# EAGLE design modular_expansion_joystick_only (EAGLE 9.2.1)
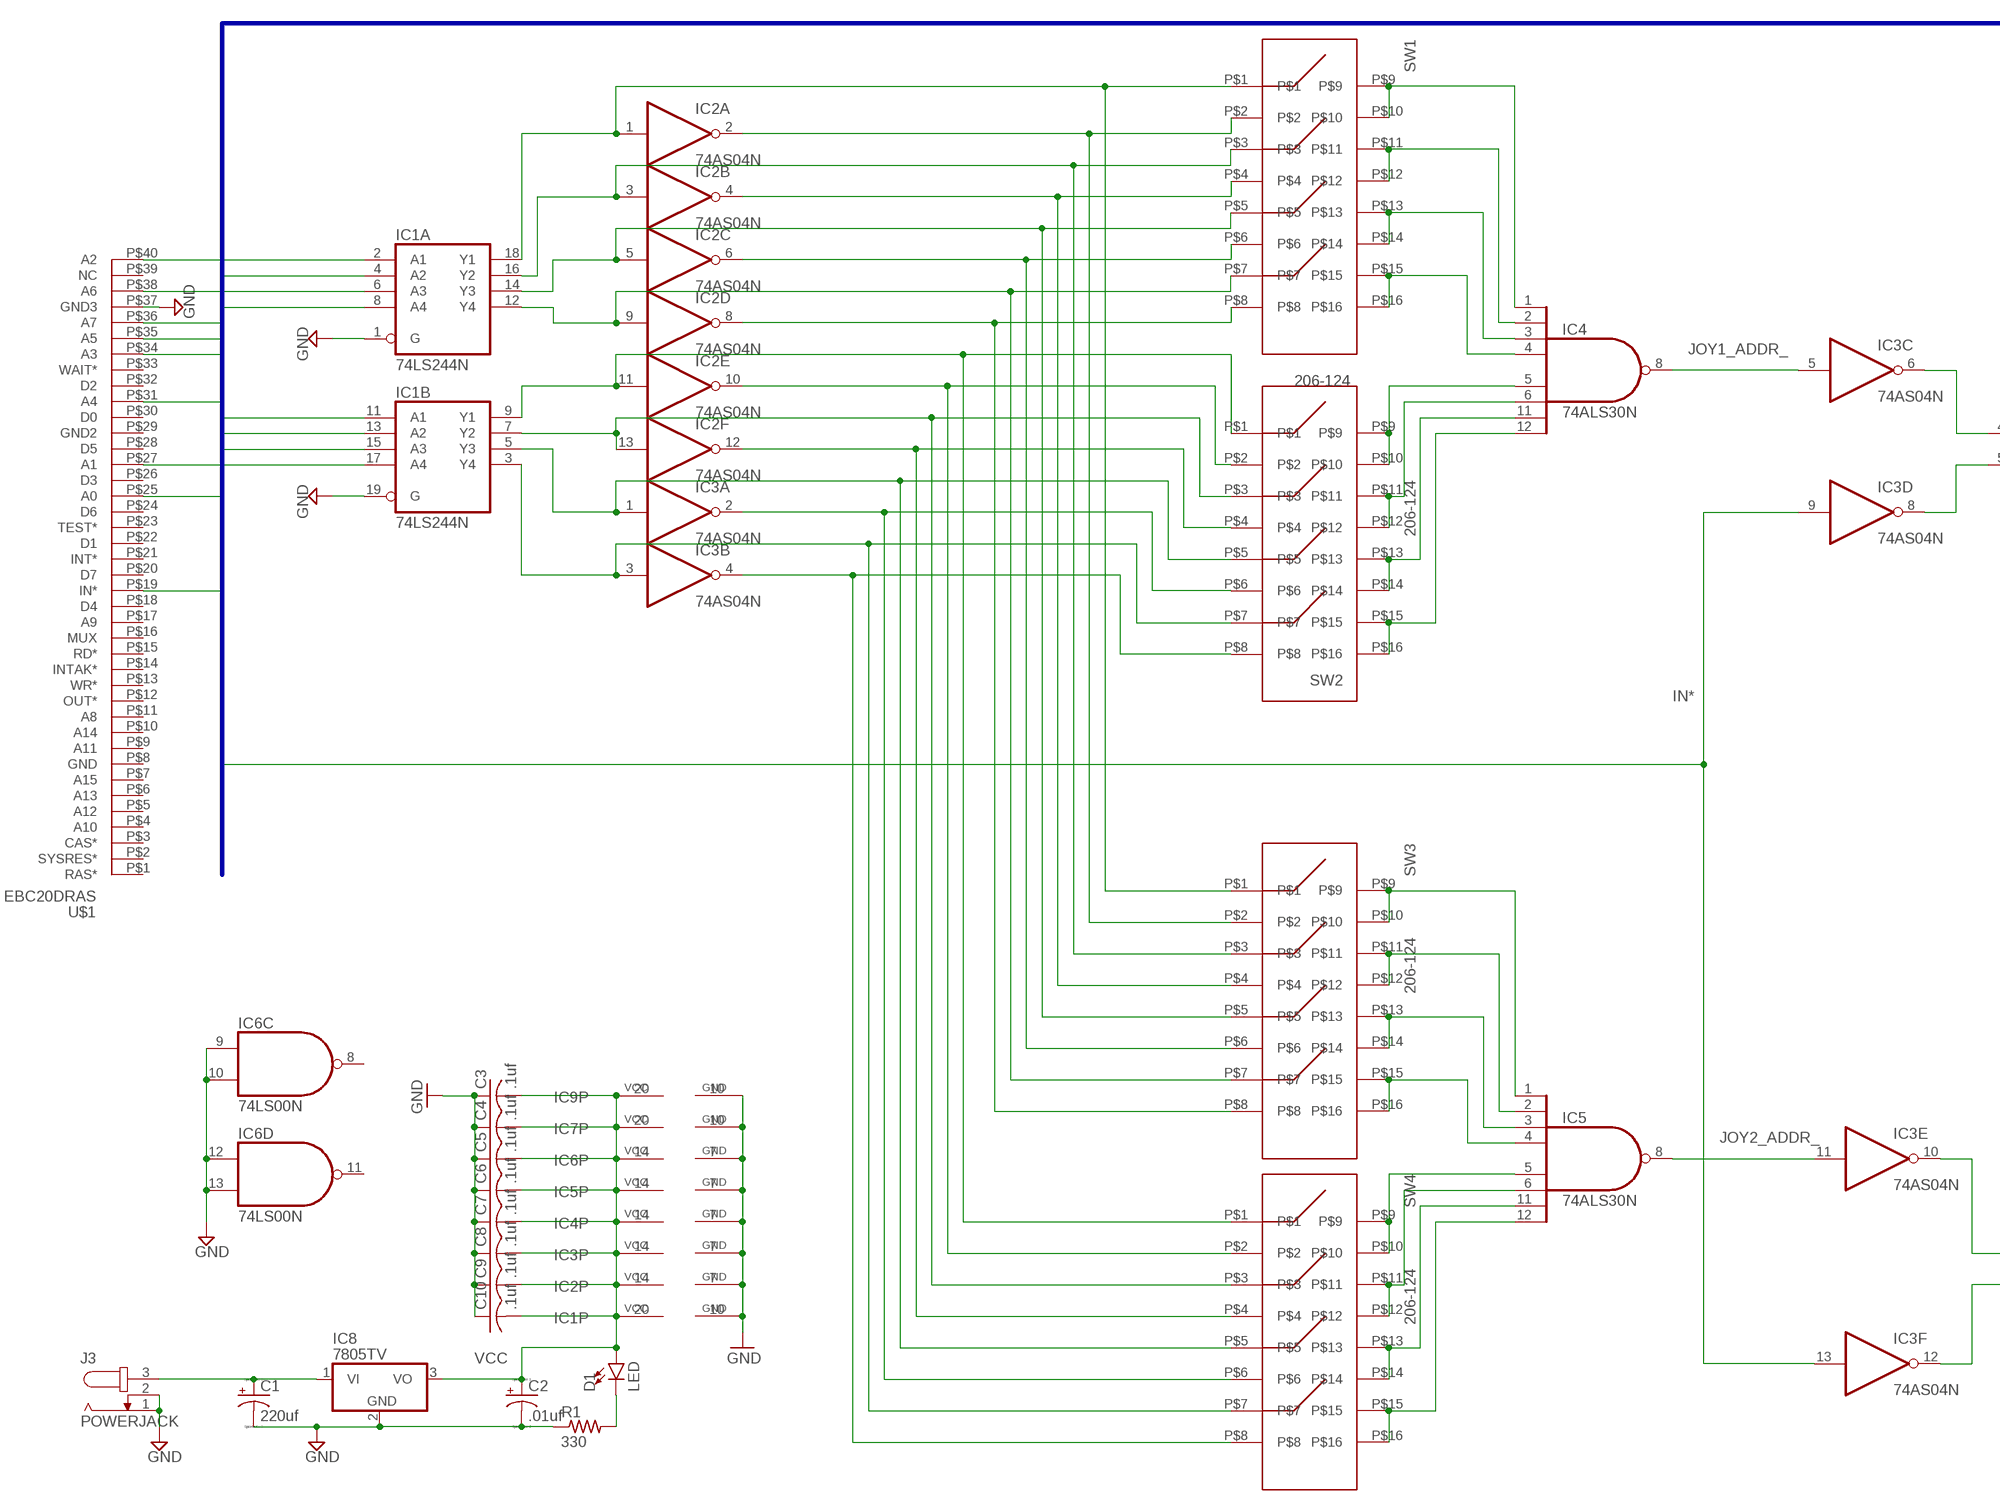
[diagram p0: schematic, sheet 1, part 1 of 2]
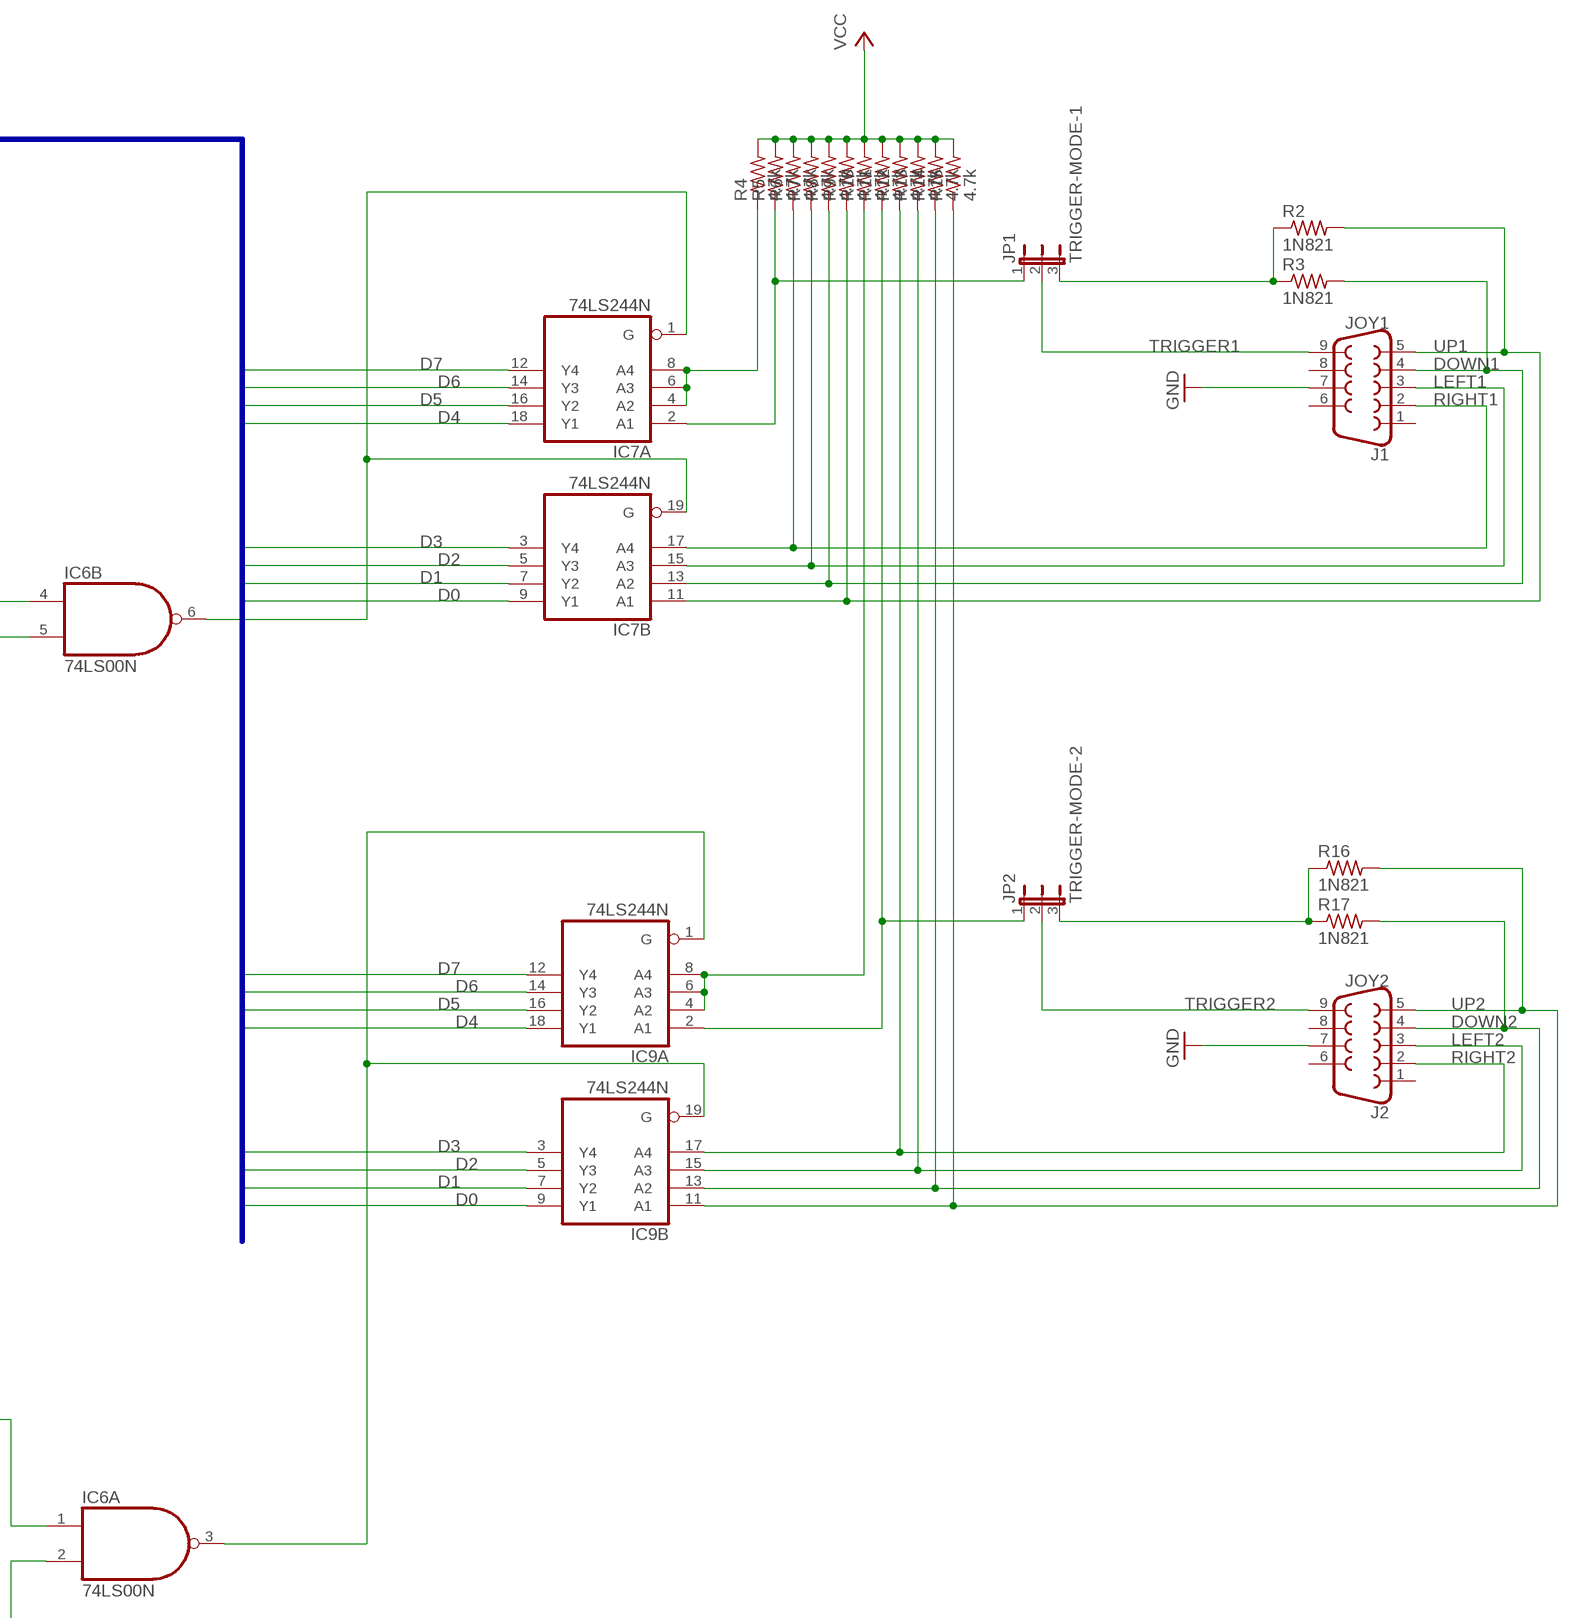
[diagram p1: schematic, sheet 1, part 2 of 2]

## Parts
C1  220uf  CPOL-USE3.5-10  [E3,5-10]
C2  .01uf  CPOL-USE2,5-6E  [E2,5-6E]
C3  .1uf  C-US025-025X050  [C025-025X050]
C4  .1uf  C-US025-025X050  [C025-025X050]
C5  .1uf  C-US025-025X050  [C025-025X050]
C6  .1uf  C-US025-025X050  [C025-025X050]
C7  .1uf  C-US025-025X050  [C025-025X050]
C8  .1uf  C-US025-025X050  [C025-025X050]
C9  .1uf  C-US025-025X050  [C025-025X050]
C10  .1uf  C-US025-025X050  [C025-025X050]
D1  LED  LED3MM  [LED_3MM]
IC1  74LS244N  [DIL20]
IC2  74AS04N  [DIL14]
IC3  74AS04N  [DIL14]
IC4  74ALS30N  [DIL14]
IC5  74ALS30N  [DIL14]
IC6  74LS00N  [DIL14]
IC7  74LS244N  [DIL20]
IC8  7805TV  [TO220V]
IC9  74LS244N  [DIL20]
J1  JOY1  DB9FEMALE  [DB9]
J2  JOY2  DB9FEMALE  [DB9]
J3  POWERJACK  JACK-PLUG0  [SPC4077]
JP1  TRIGGER-MODE-1  JP2E  [JP2]
JP2  TRIGGER-MODE-2  JP2E  [JP2]
R1  330  R-US_0204/2V  [0204V]
R2  1N821  R-US_0204/2V  [0204V]
R3  1N821  R-US_0204/2V  [0204V]
R4  4.7k  R-US_0204/5  [0204/5]
R5  4.7k  R-US_0204/5  [0204/5]
R6  4.7k  R-US_0204/5  [0204/5]
R7  4.7k  R-US_0204/5  [0204/5]
R8  4.7k  R-US_0204/5  [0204/5]
R9  4.7k  R-US_0204/5  [0204/5]
R10  4.7k  R-US_0204/5  [0204/5]
R11  4.7k  R-US_0204/5  [0204/5]
R12  4.7k  R-US_0204/5  [0204/5]
R13  4.7k  R-US_0204/5  [0204/5]
R14  4.7k  R-US_0204/5  [0204/5]
R15  4.7k  R-US_0204/5  [0204/5]
R16  1N821  R-US_0204/2V  [0204V]
R17  1N821  R-US_0204/2V  [0204V]
SW1  206-124  [206-124]
SW2  206-124  [206-124]
SW3  206-124  [206-124]
SW4  206-124  [206-124]
U$1  EBC20DRAS  [EBC20DRAS]

## Nets
A0: IC1.2(A:A1) U$1.P$25(A0)
A1: IC1.4(A:A2) U$1.P$27(A1)
A2: IC1.6(A:A3) U$1.P$40(A2)
A3: IC1.8(A:A4) U$1.P$34(A3)
A4: IC1.11(B:A1) U$1.P$31(A4)
A5: IC1.13(B:A2) U$1.P$35(A5)
A6: IC1.15(B:A3) U$1.P$38(A6)
A7: IC1.17(B:A4) U$1.P$36(A7)
D0: IC7.9(B:Y1) IC9.9(B:Y1)
D1: IC7.7(B:Y2) IC9.7(B:Y2)
D2: IC7.5(B:Y3) IC9.5(B:Y3)
D3: IC7.3(B:Y4) IC9.3(B:Y4)
D4: IC7.18(A:Y1) IC9.18(A:Y1)
D5: IC7.16(A:Y2) IC9.16(A:Y2)
D6: IC7.14(A:Y3) IC9.14(A:Y3)
D7: IC7.12(A:Y4) IC9.12(A:Y4)
DOWN1: IC7.13(B:A2) J1.4 R3.2 R8.1
DOWN2: IC9.13(B:A2) J2.4 R14.1 R17.2
GND: C1.- C2.- C3.1 C4.1 C5.1 C6.1 C7.1 C8.1 C9.1 C10.1 IC1.1(A:G) IC1.10(P:GND) IC1.19(B:G) IC2.7(P:GND) IC3.7(P:GND) IC4.7(GND) IC5.7(GND) IC6.7(P:GND) IC6.9(C:I0) IC6.10(C:I1) IC6.12(D:I0) IC6.13(D:I1) IC7.10(P:GND) IC8.2(GND) IC9.10(P:GND) J1.7 J2.7 J3.1 J3.2 R1.1 U$1.P$37(GND3)
IN*: IC3.9(D:I) IC3.13(F:I) U$1.P$19(IN*)
JOY1_ADDR_: IC3.5(C:I) IC4.8(O)
JOY1_SELECTED_: IC6.6(B:O) IC7.1(A:G) IC7.19(B:G)
JOY2_ADDR_: IC3.11(E:I) IC5.8(O)
JOY2_SELECTED_: IC6.3(A:O) IC9.1(A:G) IC9.19(B:G)
LEFT1: IC7.15(B:A3) J1.3 R7.1
LEFT2: IC9.15(B:A3) J2.3 R13.1
N$1: IC1.18(A:Y1) IC2.1(A:I) SW1.P$1 SW3.P$1
N$2: IC1.16(A:Y2) IC2.3(B:I) SW1.P$3 SW3.P$3
N$3: IC1.14(A:Y3) IC2.5(C:I) SW1.P$5 SW3.P$5
N$4: IC1.12(A:Y4) IC2.9(D:I) SW1.P$7 SW3.P$7
N$5: IC1.9(B:Y1) IC2.11(E:I) SW2.P$1 SW4.P$1
N$6: IC1.7(B:Y2) IC2.13(F:I) SW2.P$3 SW4.P$3
N$7: IC1.5(B:Y3) IC3.1(A:I) SW2.P$5 SW4.P$5
N$8: IC1.3(B:Y4) IC3.3(B:I) SW2.P$7 SW4.P$7
N$9: IC2.2(A:O) SW1.P$2 SW3.P$2
N$10: IC2.4(B:O) SW1.P$4 SW3.P$4
N$11: IC2.6(C:O) SW1.P$6 SW3.P$6
N$12: IC2.8(D:O) SW1.P$8 SW3.P$8
N$13: IC2.10(E:O) SW2.P$2 SW4.P$2
N$14: IC2.12(F:O) SW2.P$4 SW4.P$4
N$15: IC3.2(A:O) SW2.P$6 SW4.P$6
N$16: IC4.1(I0) SW1.P$9 SW1.P$10
N$17: IC4.2(I1) SW1.P$11 SW1.P$12
N$18: IC4.3(I2) SW1.P$13 SW1.P$14
N$19: IC3.4(B:O) SW2.P$8 SW4.P$8
N$20: IC4.4(I3) SW1.P$15 SW1.P$16
N$21: IC4.5(I4) SW2.P$9 SW2.P$10
N$22: IC4.6(I5) SW2.P$11 SW2.P$12
N$23: IC4.11(I6) SW2.P$13 SW2.P$14
N$24: IC4.12(I7) SW2.P$15 SW2.P$16
N$25: IC3.6(C:O) IC6.4(B:I0)
N$26: IC3.8(D:O) IC6.5(B:I1)
N$27: IC3.12(F:O) IC6.2(A:I1)
N$28: IC3.10(E:O) IC6.1(A:I0)
N$29: IC5.1(I0) SW3.P$9 SW3.P$10
N$30: IC5.2(I1) SW3.P$11 SW3.P$12
N$31: IC5.3(I2) SW3.P$13 SW3.P$14
N$32: IC5.4(I3) SW3.P$15 SW3.P$16
N$33: IC5.5(I4) SW4.P$9 SW4.P$10
N$34: IC5.6(I5) SW4.P$11 SW4.P$12
N$35: IC5.11(I6) SW4.P$13 SW4.P$14
N$36: IC5.12(I7) SW4.P$15 SW4.P$16
N$37: JP2.3 R16.1 R17.1
N$38: C1.+ IC8.1(VI) J3.3
N$39: JP1.3 R2.1 R3.1
N$40: IC9.4(A:A2) IC9.6(A:A3) IC9.8(A:A4) R10.1
N$41: D1.K(C) R1.2
N$42: IC9.2(A:A1) JP2.1 R11.1
N$43: IC7.4(A:A2) IC7.6(A:A3) IC7.8(A:A4) R4.1
N$44: IC7.2(A:A1) JP1.1 R5.1
RIGHT1: IC7.17(B:A4) J1.2 R6.1
RIGHT2: IC9.17(B:A4) J2.2 R12.1
TRIGGER1: J1.9 JP1.2
TRIGGER2: J2.9 JP2.2
UP1: IC7.11(B:A1) J1.5 R2.2 R9.1
UP2: IC9.11(B:A1) J2.5 R15.1 R16.2
VCC: C2.+ C3.2 C4.2 C5.2 C6.2 C7.2 C8.2 C9.2 C10.2 D1.A IC1.20(P:VCC) IC2.14(P:VCC) IC3.14(P:VCC) IC4.14(VCC) IC5.14(VCC) IC6.14(P:VCC) IC7.20(P:VCC) IC8.3(VO) IC9.20(P:VCC) R4.2 R5.2 R6.2 R7.2 R8.2 R9.2 R10.2 R11.2 R12.2 R13.2 R14.2 R15.2
Unconnected: IC6.8(C:O) IC6.11(D:O) J1.1 J1.6 J1.8 J2.1 J2.6 J2.8 U$1.P$1(RAS*) U$1.P$2(SYSRES*) U$1.P$3(CAS*) U$1.P$4(A10) U$1.P$5(A12) U$1.P$6(A13) U$1.P$7(A15) U$1.P$8(GND) U$1.P$9(A11) U$1.P$10(A14) U$1.P$11(A8) U$1.P$12(OUT*) U$1.P$13(WR*) U$1.P$14(INTAK*) U$1.P$15(RD*) U$1.P$16(MUX) U$1.P$17(A9) U$1.P$18(D4) U$1.P$20(D7) U$1.P$21(INT*) U$1.P$22(D1) U$1.P$23(TEST*) U$1.P$24(D6) U$1.P$26(D3) U$1.P$28(D5) U$1.P$29(GND2) U$1.P$30(D0) U$1.P$32(D2) U$1.P$33(WAIT*) U$1.P$39(NC)

## Buses
EBC20DRAS:A0,A1,A2,A3,A4,A5,A6,A7,D0,D1,D2,D3,D4,D5,D6,D7,IN*,OUT*,RD*,WR*

## Library data of the parts
C1 C2 = resistor:CPOL-US: POLARIZED CAPACITOR, American symbol
C3-C10 = resistor:C-US: CAPACITOR, American symbol
D1 = SparkFun-LED:LED: LED (Generic) Standard schematic elements and footprints for 5mm, 3mm, 1206, and 0603 sized LEDs. Generic LEDs with no color specified.; PROD_ID: DIO-08794
IC1 IC7 IC9 = 74xx-us:74*244: Octal BUFFER and LINE DRIVER, 3-state
IC2 IC3 = 74xx-us:74*04: Hex INVERTER
IC4 IC5 = 74xx-us:74*30: 8-input NAND gate
IC6 = 74xx-us:74*00: Quad 2-input NAND gate
IC8 = linear:78*: Positive VOLTAGE REGULATOR Source: http://cache.national.com/ds/LM/LM78L05.pdf http://www.fairchildsemi.com/ds/LM/LM7805.pdf
J1 J2 = SparkFun-Connectors:DB9: DB9 Connector Standard DB9 (D-Sub 9) serial connector. Can be used for CAN bus as well as RS485 and RS232. Footprint production proven. Here is the female version connector we sell at SparkFun: 9 Pin Female Serial Connector - PCB Mount <https://www.sparkfun.com/products/429> (PRT-00429) This connector has been used on the following SparkFun products: SparkFun RS232 Shifter - SMD <https://www.sparkfun.com/products/449> (PRT-00449) SparkFun RS232 Shifter SMD (No DB9) <https://www.sparkfun.com/products/8780> (PRT-08780); PROD_ID: CONN-08194
J3 = con-jack:JACK-PLUG: DC POWER JACK Power Jack, DC, Right Angle, Through Hole, Rated 5A at 16VDC, PC Terminals Distributor: Farnell (www.Farnell.de) Drawing: 84N1161.pdf / 84N1162.pdf Manufacturer: SPC Technology (www.spctechnology.com) Type: SPC4077 / SPC 4078; OC_FARNELL: unknown; OC_NEWARK: unknown
JP1 JP2 = jumper:JP2E: JUMPER
R1 = resistor:R-US_: RESISTOR, American symbol
R2-R17 = rcl:R-US_: RESISTOR, American symbol; SPICEPREFIX: R
SW1-SW4 = TMS99:206-124: 206-124 CTS SPDT Dip Switch
U$1 = TMS99:EBC20DRAS

## Board
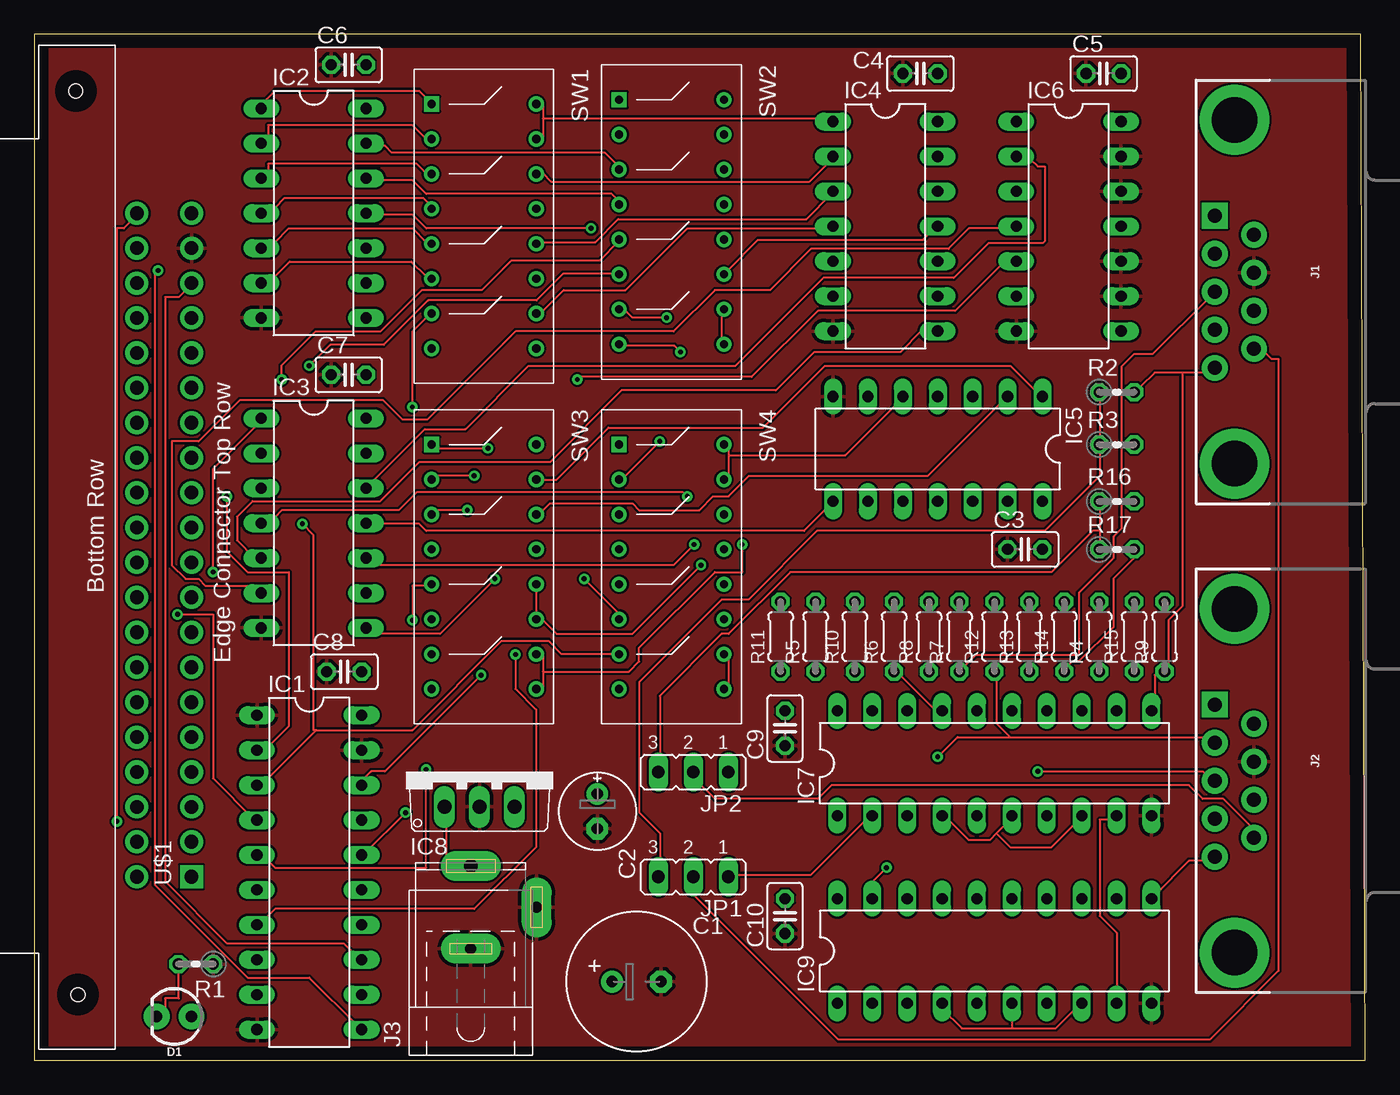
[diagram p2: board, top side]
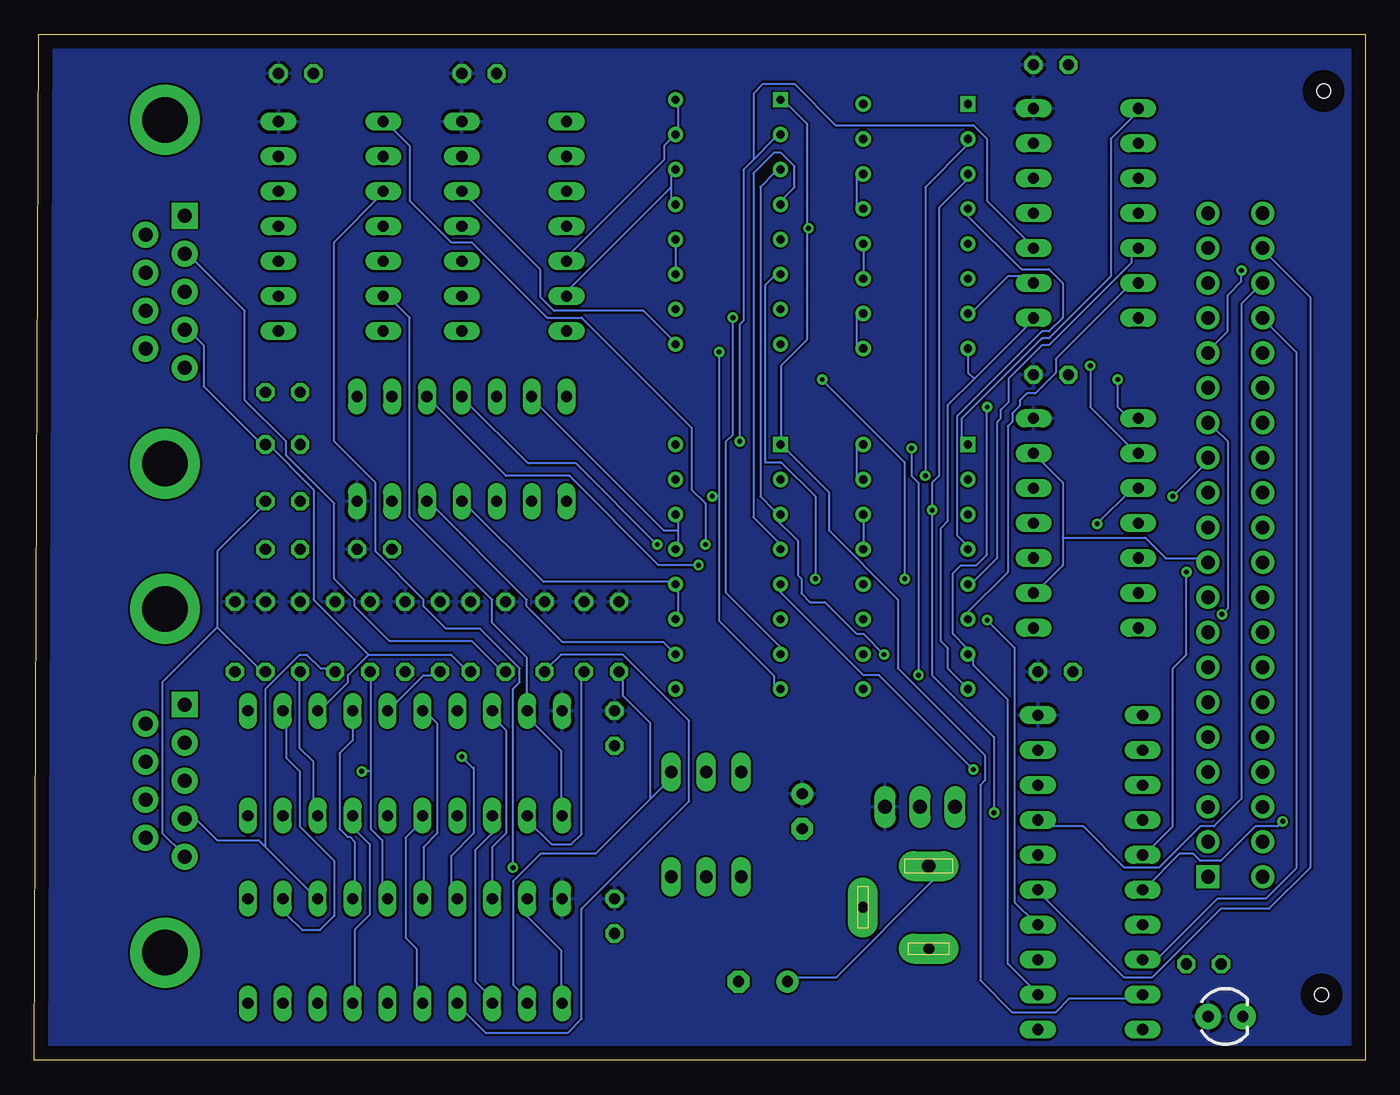
[diagram p3: board, bottom side, seen from below]

Size 96.82 x 74.6 mm. Coordinates in mm from the lower left corner, seen from the top.
Outline: 0,0 96.82,0 96.5,74.6 0,74.6 0,0
Copper layers (1*16): Top 0.035mm / dielectric 1.5mm / Bottom 0.035mm
Design rules "default": minimum track width 6mil, minimum drill 0.35mm, track to track 6mil, track to pad 6mil, pad to pad 6mil, via to via 6mil, smd to smd 6mil, copper to edge 40mil, drill to drill 6mil, minimum pad ring 10mil, minimum via ring 8mil, stop-mask expansion 4mil, vias tented up to drill 0mil, thermal gap 10mil

### Footprints (pad centres in the part's own frame; a part is rotated, then mirrored left to right if it is on the bottom)
E3,5-10 = drill 0.813 pad 1.6: + -1.778,0 | drill 0.813 pad 1.6 octagon: - 1.778,0
E2,5-6E = drill 0.813 pad 1.575: + -1.27,0 | drill 0.813 pad 1.575 octagon: - 1.27,0
C025-025X050 = drill 0.813 octagon: 1 -1.27,0; 2 1.27,0
LED_3MM = drill 0.813 pad 1.88: A -1.27,0; K 1.27,0
DIL20 = drill 0.813 long: 1 -11.43,-3.81; 2 -8.89,-3.81; 3 -6.35,-3.81; 4 -3.81,-3.81; 5 -1.27,-3.81; 6 1.27,-3.81; 7 3.81,-3.81; 8 6.35,-3.81; 9 8.89,-3.81; 10 11.43,-3.81; 11 11.43,3.81; 12 8.89,3.81; 13 6.35,3.81; 14 3.81,3.81; 15 1.27,3.81; 16 -1.27,3.81; 17 -3.81,3.81; 18 -6.35,3.81; 19 -8.89,3.81; 20 -11.43,3.81
DIL14 = drill 0.813 long: 1 -7.62,-3.81; 2 -5.08,-3.81; 3 -2.54,-3.81; 4 0,-3.81; 5 2.54,-3.81; 6 5.08,-3.81; 7 7.62,-3.81; 8 7.62,3.81; 9 5.08,3.81; 10 2.54,3.81; 11 0,3.81; 12 -2.54,3.81; 13 -5.08,3.81; 14 -7.62,3.81
TO220V = drill 1.016 long: 1 -2.54,-2.54; 2 0,-2.54; 3 2.54,-2.54
DB9 = drill 1.016 pad 1.88 square: 1 -5.54,-1.42 | drill 1.016 pad 1.88: 2 -2.77,-1.42; 3 0,-1.42; 4 2.77,-1.42; 5 5.54,-1.42; 6 -4.15,1.42; 7 -1.38,1.42; 8 1.38,1.42; 9 4.15,1.42 | drill 3.302 pad 5.08: G1 -12.5,0; G2 12.5,0
SPC4077 = drill 0.8 pad 2.184 long: 1 -3,0; 2 0,-4.8 | drill 1 pad 2.184 long: 3 3,0
JP2 = drill 0.914 long: 1 -2.54,0; 2 0,0; 3 2.54,0
0204V = drill 0.813 octagon: 1 -1.27,0; 2 1.27,0
0204/5 = drill 0.813 octagon: 1 -2.54,0; 2 2.54,0
206-124 = drill 0.6 square: P$1 0,0 | drill 0.6: P$2 2.54,0; P$3 5.08,0; P$4 7.62,0; P$5 10.16,0; P$6 12.7,0; P$7 15.24,0; P$8 17.78,0; P$9 0,7.62; P$10 2.54,7.62; P$11 5.08,7.62; P$12 7.62,7.62; P$13 10.16,7.62; P$14 12.7,7.62; P$15 15.24,7.62; P$16 17.78,7.62
EBC20DRAS = drill 1 pad 1.676 square: P$1 0,0 | drill 1 pad 1.676: P$2 0,3.969; P$3 2.54,0; P$4 2.54,3.969; P$5 5.08,0; P$6 5.08,3.969; P$7 7.62,0; P$8 7.62,3.969; P$9 10.16,0; P$10 10.16,3.969; P$11 12.7,0; P$12 12.7,3.969; P$13 15.24,0; P$14 15.24,3.969; P$15 17.78,0; P$16 17.78,3.969; P$17 20.32,0; P$18 20.32,3.969; P$19 22.86,0; P$20 22.86,3.969; P$21 25.4,0; P$22 25.4,3.969; P$23 27.94,0; P$24 27.94,3.969; P$25 30.48,0; P$26 30.48,3.969; P$27 33.02,0; P$28 33.02,3.969; P$29 35.56,0; P$30 35.56,3.969; P$31 38.1,0; P$32 38.1,3.969; P$33 40.64,0; P$34 40.64,3.969; P$35 43.18,0; P$36 43.18,3.969; P$37 45.72,0; P$38 45.72,3.969; P$39 48.26,0; P$40 48.26,3.969 | hole 1: -8.572,8.255; 57.15,8.414

### Placement (x,y rotation side)
C1  43.81,5.71 0 top
C2  40.96,18.1 270 top
C3  72.07,37.15 0 top
C4  64.45,71.75 0 top
C5  77.79,71.75 0 top
C6  22.86,72.39 0 top
C7  22.86,49.85 0 top
C8  22.54,28.26 0 top
C9  54.61,24.13 90 top
C10  54.61,10.48 90 top
D1  10.16,3.17 180 top
IC1  20,13.65 270 top
IC2  20.32,61.59 270 top
IC3  20.32,39.05 270 top
IC4  61.91,60.64 270 top
IC5  65.72,44.45 180 top
IC6  75.25,60.64 270 top
IC7  69.85,21.59 0 top
IC8  32.38,20.95 0 top
IC9  69.85,7.94 0 top
J1  87.31,55.88 270 top
J2  87.31,20.32 270 top
J3  31.75,11.11 90 top
JP1  47.94,13.34 180 top
JP2  47.94,20.95 180 top
R1  11.75,6.99 180 top
R2  78.74,48.58 0 top
R3  78.74,44.77 0 top
R4  77.47,30.8 90 top
R5  56.83,30.8 90 top
R6  62.55,30.8 90 top
R7  67.31,30.8 90 top
R8  65.09,30.8 90 top
R9  82.23,30.8 90 top
R10  59.69,30.8 90 top
R11  54.29,30.8 90 top
R12  69.85,30.8 90 top
R13  72.39,30.8 90 top
R14  74.93,30.8 90 top
R15  80.01,30.8 90 top
R16  78.74,40.64 0 top
R17  78.74,37.15 0 top
SW1  28.89,69.53 270 top
SW2  42.55,69.85 270 top
SW3  28.89,44.77 270 top
SW4  42.55,44.77 270 top
U$1  11.43,13.34 90 top

### Tracks (layer width: path | path; a pad name or v marks a point on that pad's centre or on a via)
A0  (via drill 0.35)
  Top 0.152: IC1.2 16.76,22.54 18.5,24.29 18.5,35.5 15.5,35.5 14,37 v14,41
  Bottom 0.152: v14,41 11.5,43.5 U$1.P$25
A1  (via drill 0.35)
  Top 0.152: v10.42,32.42 13,32.42 13,20.5 16,17.5 IC1.4
  Bottom 0.152: v10.42,32.42 10,32.84 10,45 11,46 U$1.P$27
A2  (via drill 0.35)
  Top 0.152: v6,17.36 6,60.5 6.5,60.5 7.5,61.5 U$1.P$40
  Bottom 0.152: v6,17.36 6.37,17 8,17 10.5,14.5 12,14.5 12.5,15 13.5,15 16,12.5 IC1.6
A3
  Bottom 0.152: IC1.8 16,7.5 15,7.5 10.75,11.75 7.22,11.75 5,13.97 5,51.5 7,53.5 U$1.P$34
A4  (via drill 0.35)
  Top 0.152: v9,57.43 8.76,57.19 8.76,12.74 15.5,6 20,6 23.5,2.5 IC1.11
  Bottom 0.152: v9,57.43 9,56.63 10,55.63 10,53 11.5,51.5 U$1.P$31
A5
  Top 0.152: IC1.13 23.5,7.5 22.5,8.5 14,8.5 9.5,13 9.5,55.5 10.5,55.5 11.5,56.5 U$1.P$35
A6
  Bottom 0.152: IC1.15 23.5,12 17.5,6 15.5,6 10.5,11 7,11 4,14 4,55.5 7.5,59 U$1.P$38
A7
  Bottom 0.152: IC1.17 23.5,17 20.5,17 17.5,14 15,14 12,17 11,17 9,19 9,55 7.5,56.5 U$1.P$36
D0
  Top 0.152: IC7.9 78.5,17.5 77.5,17.5 77.5,10.5 78.74,9.26 IC9.9
D1
  Bottom 0.152: IC9.7 73.5,4.5 73.5,9.5 72.42,10.58 72.42,15.71 73.66,16.95 IC7.7
D2
  Bottom 0.152: IC9.5 69,4.5 69,8.1 69.82,8.91 69.82,16.18 68.5,17.5 IC7.5
D3
  Bottom 0.152: IC7.3 63.5,16.5 64.74,15.26 64.74,5.74 63.5,4.5 IC9.3
D4
  Bottom 0.152: IC9.18 63.5,15.5 62.5,16.5 62.5,24 63.5,25 IC7.18
D5
  Bottom 0.152: IC9.16 68.5,12 68.5,15.5 67.5,16.5 67.5,24.5 68.5,25.5 IC7.16
D6
  Bottom 0.152: IC7.14 73.66,23.26 74.61,22.3 74.61,16.82 74.03,16.23 73.86,16.23 73.5,15.88 73.5,11.91 IC9.14
D7
  Bottom 0.152: IC9.12 78.5,11.5 78.5,10.63 77.32,9.44 76.06,9.44 75,10.5 75,14.5 77.5,17 77.5,21 78.5,22 78.5,25 IC7.12
DOWN1
  Bottom 0.152: 72.5,29.5 66.5,29.5 65.5,28.5 R8.1 | 72.5,29.5 74,28 74,27.5 76,25.5 IC7.13 | J1.4 85.5,53 84.5,52 84.5,49 80.5,45 R3.2 80,45 76.5,41.5 76.5,33.5 72.5,29.5
DOWN2
  Top 0.152: R14.1 75,28.5 75.5,29 76,29 78.5,31.5 78.5,35 80.5,37 R17.2
  Bottom 0.152: 80,15.5 80.5,16 83.5,16 85.5,18 J2.4 | 80,15.5 76.5,12 IC9.13 | 80,15.5 80,27 77.5,29.5 77,29.5 76,28.5 75,28.5 R14.1
GND
  pour Top: 0,0 102.55,0 102.55,74.61 0,74.61
IN*
  Bottom 0.152: 22,38 22,42 24,44 IC3.13 | 22,38 22,36 24,34 IC3.9 | 22,38 16,38 14.5,36.5 11.5,36.5 U$1.P$19
JOY1_ADDR_
  Top 0.152: IC4.8 65.5,53 64.5,53 63,51.5 56.73,51.5 53.94,48.71 42.71,48.71 37.5,43.5 28,43.5 25.16,40.66 15.87,40.66 14.74,39.53 14.74,37.81 16.03,36.51 IC3.5
JOY1_SELECTED_
  Bottom 0.152: IC7.1 58.5,18 58.5,22.5 61,25 IC7.19 | 61,29.29 61.02,29.31 | 61.02,29.31 61.06,29.35 63.5,31.79 63.5,33.5 69.5,39.5 69.5,54 71,55.5 IC6.6 | 61,25.5 IC7.19 | 61.02,29.31 61.02,25.46 IC7.19
JOY2_ADDR_
  Top 0.152: IC3.11 24.5,39 28,39 28.5,38.5 56,38.5 58,40.5 IC5.8
JOY2_SELECTED_  (via drill 0.35)
  Top 0.152: v62,14 61,13 61,12 IC9.19
  Bottom 0.152: IC9.1 58.5,4.5 58.5,8 61,10.5 61,11.5 IC9.19 | v62,14 62,27 61.5,27.5 61.5,28.5 64.37,31.37 66.87,31.37 68.5,33 68.5,33.5 72,37 72,42 75,45 75,59.5 71.5,63 IC6.3
LEFT1
  Top 0.152: J1.3 85.5,55.5 81.36,51.36 80.01,51.36 79.09,50.44 79.09,38.66 78.54,38.1 78.5,38.1 78.5,36.5 76,34 76,29.5 68.5,29.5 67.5,28.5 R7.1
  Bottom 0.152: R7.1 67.5,28 68.5,28 71,25.5 IC7.15
LEFT2  (via drill 0.35)
  Top 0.152: v73,21 85,21 85.5,20.5 J2.3
  Bottom 0.152: R13.1 72.34,28.21 72.34,21 | 72.34,21 72.34,16.84 71.5,16 71.5,12 IC9.15 | 72.34,21 v73,21
N$1  (via drill 0.35)
  Top 0.152: SW1.P$1 28.5,70 28,70.5 17.5,70.5 16.5,69.5 IC2.1 | v32.5,28 25.5,21 24.5,21 24,20.5 IC1.18 | v33,44.5 29,44.5 SW3.P$1
  Bottom 0.152: IC2.1 16.5,69 18.5,67 18.5,57 23,52.5 23.5,52.5 29.37,46.63 29.37,45.24 SW3.P$1 | v32.5,28 32.5,42 33,42.5 v33,44.5
N$2  (via drill 0.35)
  Top 0.152: v31.5,40 29,40 SW3.P$3 | v27,18 24,15 IC1.16 | IC2.3 17,64.5 17,65.18 27.82,65.18 28.5,64.5 SW1.P$3
  Bottom 0.152: SW1.P$3 29,64 31,62 31,42.5 31.5,42 v31.5,40 31.5,28 27,23.5 v27,18
N$3  (via drill 0.35)
  Top 0.152: SW1.P$5 28.5,59.5 27.5,60.5 18.5,60.5 17.5,59.5 17,59.5 IC2.5 | v27.5,32 27.5,34.5 28.5,34.5 SW3.P$5
  Bottom 0.152: SW3.P$5 28.68,34.61 26.74,36.55 26.74,46.43 26.51,46.67 26.51,47.3 25.92,47.88 25.92,49.58 23.5,52 23,52 17,58 17,59 IC2.5 | v27.5,32 25.5,30 25.5,11.5 24,10 IC1.14
N$4  (via drill 0.35)
  Top 0.152: v27.5,47.5 27.5,53 28.5,54 SW1.P$7
  Bottom 0.152: SW1.P$7 28.5,54.5 26,57 24.5,57 IC2.9 | IC1.12 24,5 26,7 26,26.21 28.5,28.71 28.5,29.5 SW3.P$7 29,30 30,31 30,35.4 29.42,35.98 28.29,35.98 27.5,36.76 v27.5,47.5
N$5  (via drill 0.35)
  Top 0.152: v40.5,60.5 28.5,60.5 27.5,61.5 24.5,61.5 IC2.11
  Bottom 0.152: 40.6,60.5 40.6,68.1 42.5,70 SW2.P$1 | 40.6,60.5 40.6,52.4 42.5,50.5 42.5,45 SW4.P$1 42.47,44.77 39.02,41.32 39.02,38.52 34,33.5 34,28.5 27.66,22.16 27.66,20.34 28,20 28,5.81 25.69,3.5 22.5,3.5 21.5,4.5 16.5,4.5 IC1.9 | 40.6,60.5 v40.5,60.5
N$6  (via drill 0.35)
  Top 0.152: v35,29.5 35,27 36.5,25.5 36.5,15.5 32,11 17.5,11 16.5,10 IC1.7 | IC2.13 24.5,66.5 25.5,66.5 26,66 41.5,66 42.5,65 SW2.P$3
  Bottom 0.152: SW2.P$3 43,64.5 44,63.5 44,41 43,40 SW4.P$3 43,39.5 41.26,37.76 41.26,35.26 41.02,35.02 41.02,33.96 40.38,33.31 39.31,33.31 37,31 36.5,31 v35,29.5
N$7  (via drill 0.35)
  Top 0.152: v18,49.5 18,50.53 20.47,53 25.18,53 28.18,56 32.54,56 34.69,58.15 41.12,58.15 42.55,59.57 SW2.P$5 | v28.5,21.14 28.5,14 17.5,14 17,14.5 16.5,14.5 IC1.5 | v13,35.5 13,43 16.5,46.5 IC3.1
  Bottom 0.152: v18,49.5 18,47.5 17,46.5 IC3.1 | v28.5,21.14 35.37,28 36.5,28 42.5,34 42.5,34.5 SW4.P$5 | v13,35.5 13,29.5 14,28.5 14,17 16,15 IC1.5
N$8  (via drill 0.35)
  Top 0.152: SW4.P$7 38.37,29.53 37.4,30.5 34,30.5 27.5,24 20.5,24 | 20.5,24 17,20.5 16.5,20.5 IC1.3 | v46,54 43.5,54 43,54.5 SW2.P$7 | v19.5,39 20.29,38.21 20.29,24 20.5,24
  Bottom 0.152: v46,54 46,45.5 46.5,45 46.5,34 42.5,30 SW4.P$7 | v19.5,39 17,41.5 IC3.3
N$9  (via drill 0.35)
  Top 0.152: v32,42.5 29,42.5 SW3.P$2 | IC2.2 17,67 17,68 27.5,68 28.5,67 SW1.P$2
  Bottom 0.152: v32,42.5 32,63.5 29,66.5 SW1.P$2
N$10
  Top 0.152: IC2.4 17,62 17.5,62 18.18,62.68 28.32,62.68 29,62 SW1.P$4
  Bottom 0.152: SW3.P$4 29,37.5 29.68,38.18 29.68,46.82 23.5,53 23,53 22,54 22,56.5 23.02,57.52 25.02,57.52 29,61.5 SW1.P$4
N$11
  Top 0.152: SW1.P$6 28.5,57 27.42,58.08 18.58,58.08 17.5,57 17,57 IC2.6
  Bottom 0.152: SW3.P$6 29,32.5 26,35.5 26,46.11 25.68,46.43 25.68,47.04 25.12,47.6 25.12,47.98 24.6,48.5 24,48.5 22.5,50 22.5,51 17,56.5 IC2.6
N$12
  Bottom 0.152: SW3.P$8 29,27 29,27.13 30.34,28.47 30.34,29.94 30.88,30.48 30.88,38.68 30.34,39.21 30.34,47.66 28.44,49.56 | 29,51.5 SW1.P$8 28.89,50.01 28.44,49.56 | 28.44,49.56 24.5,53.5 IC2.8
N$13  (via drill 0.35)
  Top 0.152: v45.5,45 43,42.5 SW4.P$2
  Bottom 0.152: v45.5,45 45.5,53.5 45.24,53.76 45.24,64.76 44.48,65.52 | 44.48,65.52 43,67 SW2.P$2 | 44.48,65.52 44.48,70.32 43.79,71 41.52,71 38.52,68 28.5,68 27.5,67 27.5,62.5 24.5,59.5 IC2.10
N$14
  Top 0.152: IC2.12 24.5,64 27.5,64 28.5,63 42,63 42.5,62.5 SW2.P$4
  Bottom 0.152: SW4.P$4 42.5,37.5 44.5,39.5 44.5,64.5 43,66 42.5,66 41.5,65 41.5,63.5 42.5,62.5 SW2.P$4
N$15  (via drill 0.35)
  Top 0.152: v40,35 42.5,32.5 SW4.P$6 | v20,50.5 21.52,52.02 25.42,52.02 28.66,55.26 36.55,55.26 38.47,57.18 42.54,57.18 SW2.P$6
  Bottom 0.152: v40,35 40,41 42.5,43.5 43.66,43.5 43.66,56.34 43,57 SW2.P$6 | v20,50.5 20,47.5 17,44.5 IC3.2
N$16
  Top 0.152: 37,68.5 37,69.5 SW1.P$9 | 37,68.5 37,67 SW1.P$10 | 37,68.5 58,68.5 IC4.1
N$17
  Top 0.152: IC4.2 58,65.5 56.4,63.9 37.6,63.9 37,64.5 SW1.P$11
  Bottom 0.152: SW1.P$12 37,62 37,64.5 SW1.P$11
N$18
  Top 0.152: IC4.3 58,63 56.16,61.16 42.48,61.16 40.82,59.5 37,59.5 SW1.P$13
  Bottom 0.152: SW1.P$14 36.5,57 36.5,59 SW1.P$13
N$19  (via drill 0.35)
  Top 0.152: v47,51.5 46.56,51.94 42.67,51.94 SW2.P$8 | v47.5,41 47.18,41.32 27.83,41.32 26.51,40 18,40 17.5,39.5 17,39.5 IC3.4
  Bottom 0.152: v47,51.5 47,41 | 47,41 47,31.94 43,27.94 43,27 SW4.P$8 | 47,41 v47.5,41
N$20
  Top 0.152: IC4.4 58,60.5 47.5,60.5 43,56 38.5,56 37,54.5 SW1.P$15
  Bottom 0.152: SW1.P$16 37,52 37,54 SW1.P$15
N$21
  Bottom 0.152: SW2.P$9 50,69.5 50,67.5 SW2.P$10 50.5,67 51,66.5 51,65.5 58,58.5 IC4.5
N$22
  Bottom 0.152: 50.5,63.5 50.5,64.5 SW2.P$11 | 50.5,63.5 50.5,62.5 SW2.P$12 | 50.5,63.5 58,56 IC4.6
N$23
  Top 0.152: IC4.11 65.5,60.5 64.66,59.66 52.66,59.66 50.5,57.5 SW2.P$14
  Bottom 0.152: SW2.P$13 SW2.P$14
N$24
  Top 0.152: SW2.P$16 50,52.5 50,54.5 SW2.P$15
  Bottom 0.152: IC4.12 65.5,63 60,57.5 60,55.5 59,54.5 52.5,54.5 50.5,52.5 SW2.P$16
N$25
  Top 0.152: IC3.6 16.5,34 16,34.5 12.44,34.5 11.94,35 11,35 10,36 10,45 11.94,45 14.94,48 25.36,48 26.79,46.58 28.58,46.58 35,53 46.5,53 49.5,56 53.5,56 56.5,59 66.5,59 68,60.5 71,60.5 IC6.4
N$26  (via drill 0.35)
  Top 0.152: v33.5,35 29.5,31 24.5,31 IC3.8 | v39.5,49.5 39.68,49.68 52.18,49.68 57,54.5 67,54.5 70.5,58 71,58 IC6.5
  Bottom 0.152: v33.5,35 33.5,43.5 v39.5,49.5
N$27
  Top 0.152: IC3.12 24.5,42 28.4,45.9 31.35,45.9 35.96,50.5 51,50.5 57.4,56.9 66.9,56.9 69.42,59.42 73.37,59.42 73.5,59.55 73.5,65 73,65 72.5,65.5 71.5,65.5 IC6.2
N$28  (via drill 0.35)
  Top 0.152: v48,37.5 46.5,36 25,36 24.5,36.5 IC3.10
  Bottom 0.152: v48,37.5 48,40.5 49,41.5 49,46 57,54 59.5,54 65,59.5 66.5,59.5 69.5,62.5 69.5,66.5 71,68 IC6.1
N$29
  Top 0.152: IC5.1 73,48.5 71,50.5 57.5,50.5 53,46 41.77,46 38,42.23 SW3.P$10
  Bottom 0.152: SW3.P$10 37,42.5 37,44.5 SW3.P$9
N$30
  Top 0.152: IC5.2 70.5,48 65,42.5 52,42.5 50.5,41 49.37,41 48.37,40 44,40 43.5,40.5 37.5,40.5 37,40 36.5,40 SW3.P$11
  Bottom 0.152: SW3.P$12 36.5,37.5 36.5,39.5 SW3.P$11
N$31  (via drill 0.35)
  Top 0.152: SW3.P$13 36.5,34.5 36.5,32.5 SW3.P$14 37,32 38,31 43.5,31 v48.5,36
  Bottom 0.152: v48.5,36 51.4,36 57.9,42.5 62.5,42.5 68,48 IC5.3
N$32  (via drill 0.35)
  Top 0.152: 37,28.26 37,29.5 SW3.P$15 | 37,28.26 37,27 SW3.P$16 | v51.5,37.5 51.5,35.5 49.5,35.5 44,30 44,29 43.26,28.26 37,28.26
  Bottom 0.152: v51.5,37.5 57.4,43.4 60.9,43.4 65.5,48 IC5.4
N$33
  Top 0.152: 50.5,44 50.5,44.5 SW4.P$9 | 50.5,44 50.5,42.5 SW4.P$10 | 50.5,44 59,44 63,48 IC5.5
N$34
  Bottom 0.152: 50,38.5 50,39.5 SW4.P$11 | 50,38.5 50,37.5 SW4.P$12 | 50,38.5 51,38.5 60.5,48 IC5.6
N$35
  Bottom 0.152: SW4.P$14 50,32.5 50,34.5 SW4.P$13 50.32,34.79 59.79,34.79 65.5,40.5 IC5.11
N$36
  Top 0.152: SW4.P$16 50.5,27 50.5,29.5 SW4.P$15
  Bottom 0.152: IC5.12 68,40.5 61,33.5 61,33 58.4,30.4 51.03,30.4 SW4.P$15
N$37
  Top 0.152: 77.5,38.5 77.5,40.5 R16.1 | 77.5,38.5 77.5,37.5 R17.1 | 77.5,38.5 77,38.5 74,35.5 55,35.5 50.5,31 50,31 45.5,26.5 45.5,21 JP2.3
N$38
  Top 0.152: IC8.1 30,18 30,14.5 31.5,14.5 J3.3
  Bottom 0.152: C1.+ 42,6 38.5,6 31.5,13 31.5,14 J3.3
N$39
  Top 0.152: R2.1 77.5,48.5 77.5,45 R3.1 77.5,44.5 77.5,42.5 73.5,38.5 56.94,38.5 51.94,33.5 50,33.5 44,27.5 44,18.02 45.5,16.52 45.5,13.5 JP1.3
N$40
  Top 0.152: IC9.4 66.04,3.75 67.47,2.32 71.2,2.32 | IC9.8 76,4 74.32,2.32 71.2,2.32 | IC9.6 71.12,2.4 71.2,2.32
  Bottom 0.152: R10.1 59.5,28.5 58.5,29.5 54,29.5 49.18,24.68 49.18,18.82 57,11 57,3 58,2 64,2 66,4 IC9.4
N$41
  Top 0.152: R1.2 10.5,6.5 10.5,4.5 9.5,4.5 9.5,3.79 D1.K
N$42
  Bottom 0.152: 52,19 50.5,20.5 JP2.1 | 52,19 56,15 60,15 62,13 62,5.5 61,4.5 IC9.2 | 52,19 52,24.5 54,26.5 54,28 R11.1
N$43
  Top 0.152: 70,16.5 71,17.5 IC7.6 | 70,16.5 69.5,16 68,16 66.5,17.5 IC7.4 | 70,16.5 71,15.5 74,15.5 76,17.5 IC7.8
  Bottom 0.152: R4.1 77.5,28 77.5,22.69 76.5,21.69 76.5,18 IC7.8
N$44
  Top 0.152: IC7.2 60.5,17.5 56.5,13.5 50.5,13.5 JP1.1
  Bottom 0.152: R5.1 57,28 57,16.44 57.76,15.68 59.18,15.68 61,17.5 IC7.2
RIGHT1
  Top 0.152: R6.1 63,28 65.5,25.5 66,25.5 IC7.17
  Bottom 0.152: J1.2 85.5,58.5 81.5,54.5 81.5,48 78.5,45 78.5,44 75,40.5 75,35 73.5,33.5 73.5,33 70.98,30.48 64.98,30.48 63,28.5 R6.1
RIGHT2  (via drill 0.35)
  Top 0.152: 71,23.5 85.5,23.5 J2.2 | 71,23.5 70,24.5 70,28 R12.1 | v65.72,22.07 67.16,23.5 71,23.5
  Bottom 0.152: IC9.17 66.5,12 66.5,14.84 64.85,16.49 64.85,21.27 64.93,21.27 v65.72,22.07
TRIGGER1
  Top 0.152: JP1.2 48,13 48,12 58.5,1.5 85.5,1.5 90.5,6.5 90.5,51 90,51 89.5,51.5 89,51.5 J1.9
TRIGGER2
  Top 0.152: JP2.2 48,20.5 49.5,19 57,19 58,20 84,20 85,19 86.5,19 89,16.5 J2.9
UP1
  Top 0.152: IC7.11 81.5,25.5 81.5,28 82,28 R9.1 82.5,28.5 82.5,32 83.5,33 83.5,50 | 83.5,50 85.5,50 J1.5 | 83.5,50 81.5,50 80.5,49 R2.2
UP2
  Top 0.152: IC9.11 81.5,12 84,14.5 85.5,14.5 J2.5
  Bottom 0.152: 83.5,31.5 80.5,28.5 R15.1 | 83.5,31.5 83.5,37 80,40.5 R16.2 | 83.5,31.5 87.5,27.5 87.5,16.5 86,15 J2.5
VCC
  pour Bottom: 0,0 102.55,0 102.55,74.61 0,74.61